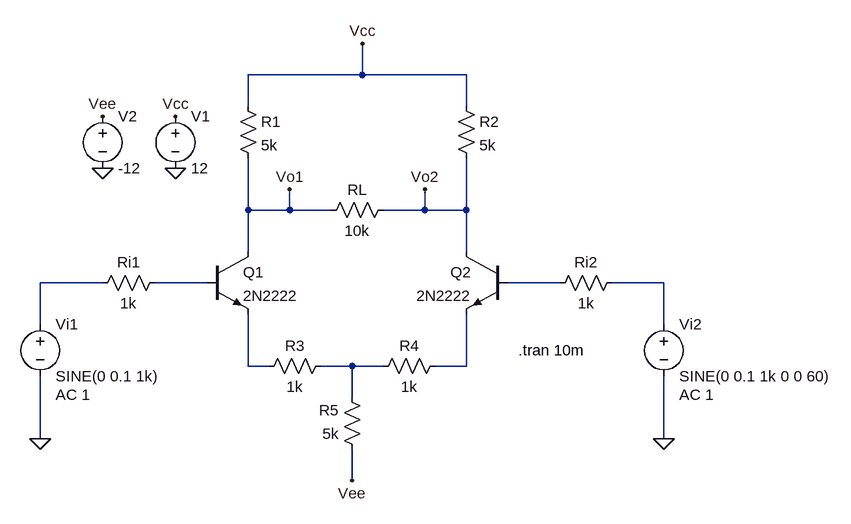
[diagram p0: schematic Differential_BJT_Amplifier.asc]
Differential_BJT_Amplifier.asc, the LTspice schematic file:
Version 4.1
SHEET 1 1048 680
WIRE 304 -192 304 -240
WIRE 304 -192 128 -192
WIRE 464 -192 304 -192
WIRE 128 -144 128 -192
WIRE 464 -144 464 -192
WIRE 128 16 128 -64
WIRE 192 16 192 -16
WIRE 192 16 128 16
WIRE 256 16 192 16
WIRE 400 16 400 -16
WIRE 400 16 336 16
WIRE 464 16 464 -64
WIRE 464 16 400 16
WIRE 128 80 128 16
WIRE 464 80 464 16
WIRE -96 128 -192 128
WIRE 64 128 -16 128
WIRE 608 128 528 128
WIRE 768 128 688 128
WIRE -192 192 -192 128
WIRE 768 192 768 128
WIRE 128 256 128 176
WIRE 160 256 128 256
WIRE 288 256 240 256
WIRE 336 256 288 256
WIRE 464 256 464 176
WIRE 464 256 416 256
WIRE 288 304 288 256
WIRE -192 368 -192 272
WIRE 768 368 768 272
WIRE 288 432 288 384
FLAG -192 368 0
FLAG 768 368 0
FLAG 16 -128 Vcc
FLAG 304 -240 Vcc
FLAG 288 432 Vee
FLAG 192 -16 Vo1
FLAG 400 -16 Vo2
FLAG -96 -128 Vee
FLAG -96 -48 0
FLAG 16 -48 0
SYMBOL npn 64 80 R0
SYMATTR InstName Q1
SYMATTR Value 2N2222
SYMBOL npn 528 80 M0
SYMATTR InstName Q2
SYMATTR Value 2N2222
SYMBOL res 112 -160 R0
SYMATTR InstName R1
SYMATTR Value 5k
SYMBOL res 448 -160 R0
SYMATTR InstName R2
SYMATTR Value 5k
SYMBOL res 256 240 R90
WINDOW 0 0 56 VBottom 2
WINDOW 3 32 56 VTop 2
SYMATTR InstName R3
SYMATTR Value 1k
SYMBOL res 432 240 R90
WINDOW 0 0 56 VBottom 2
WINDOW 3 32 56 VTop 2
SYMATTR InstName R4
SYMATTR Value 1k
SYMBOL res 304 400 R180
WINDOW 0 36 76 Left 2
WINDOW 3 36 40 Left 2
SYMATTR InstName R5
SYMATTR Value 5k
SYMBOL res 240 32 R270
WINDOW 0 32 56 VTop 2
WINDOW 3 0 56 VBottom 2
SYMATTR InstName RL
SYMATTR Value 10k
SYMBOL res 0 112 R90
WINDOW 0 0 56 VBottom 2
WINDOW 3 32 56 VTop 2
SYMATTR InstName Ri1
SYMATTR Value 1k
SYMBOL res 704 112 R90
WINDOW 0 0 56 VBottom 2
WINDOW 3 32 56 VTop 2
SYMATTR InstName Ri2
SYMATTR Value 1k
SYMBOL voltage -192 176 R0
WINDOW 123 24 124 Left 2
WINDOW 39 0 0 Left 0
SYMATTR Value2 AC 1
SYMATTR InstName Vi1
SYMATTR Value SINE(0 0.1 1k)
SYMBOL voltage 768 176 R0
WINDOW 123 24 124 Left 2
WINDOW 39 0 0 Left 0
SYMATTR Value2 AC 1
SYMATTR InstName Vi2
SYMATTR Value SINE(0 0.1 1k 0 0 60)
SYMBOL voltage 16 -144 R0
WINDOW 123 0 0 Left 0
WINDOW 39 0 0 Left 0
SYMATTR InstName V1
SYMATTR Value 12
SYMBOL voltage -96 -144 R0
WINDOW 123 0 0 Left 0
WINDOW 39 0 0 Left 0
SYMATTR InstName V2
SYMATTR Value -12
TEXT 544 232 Left 2 !.tran 10m

The netlist it stands for:
* Differential_BJT_Amplifier.asc
Q1 Vo1 N002 N005 0 2N2222
Q2 Vo2 N003 N007 0 2N2222
R1 Vcc Vo1 5k
R2 Vcc Vo2 5k
R3 N006 N005 1k
R4 N007 N006 1k
R5 Vee N006 5k
RL Vo1 Vo2 10k
Ri1 N002 N001 1k
Ri2 N004 N003 1k
Vi1 N001 0 SINE(0 0.1 1k) AC 1
Vi2 N004 0 SINE(0 0.1 1k 0 0 60) AC 1
V1 Vcc 0 12
V2 Vee 0 -12
.model NPN NPN
.model PNP PNP
.lib standard.bjt
.tran 10m
.backanno
.end